# Altium project Machkhuechdaiamthanh.PrjPcb
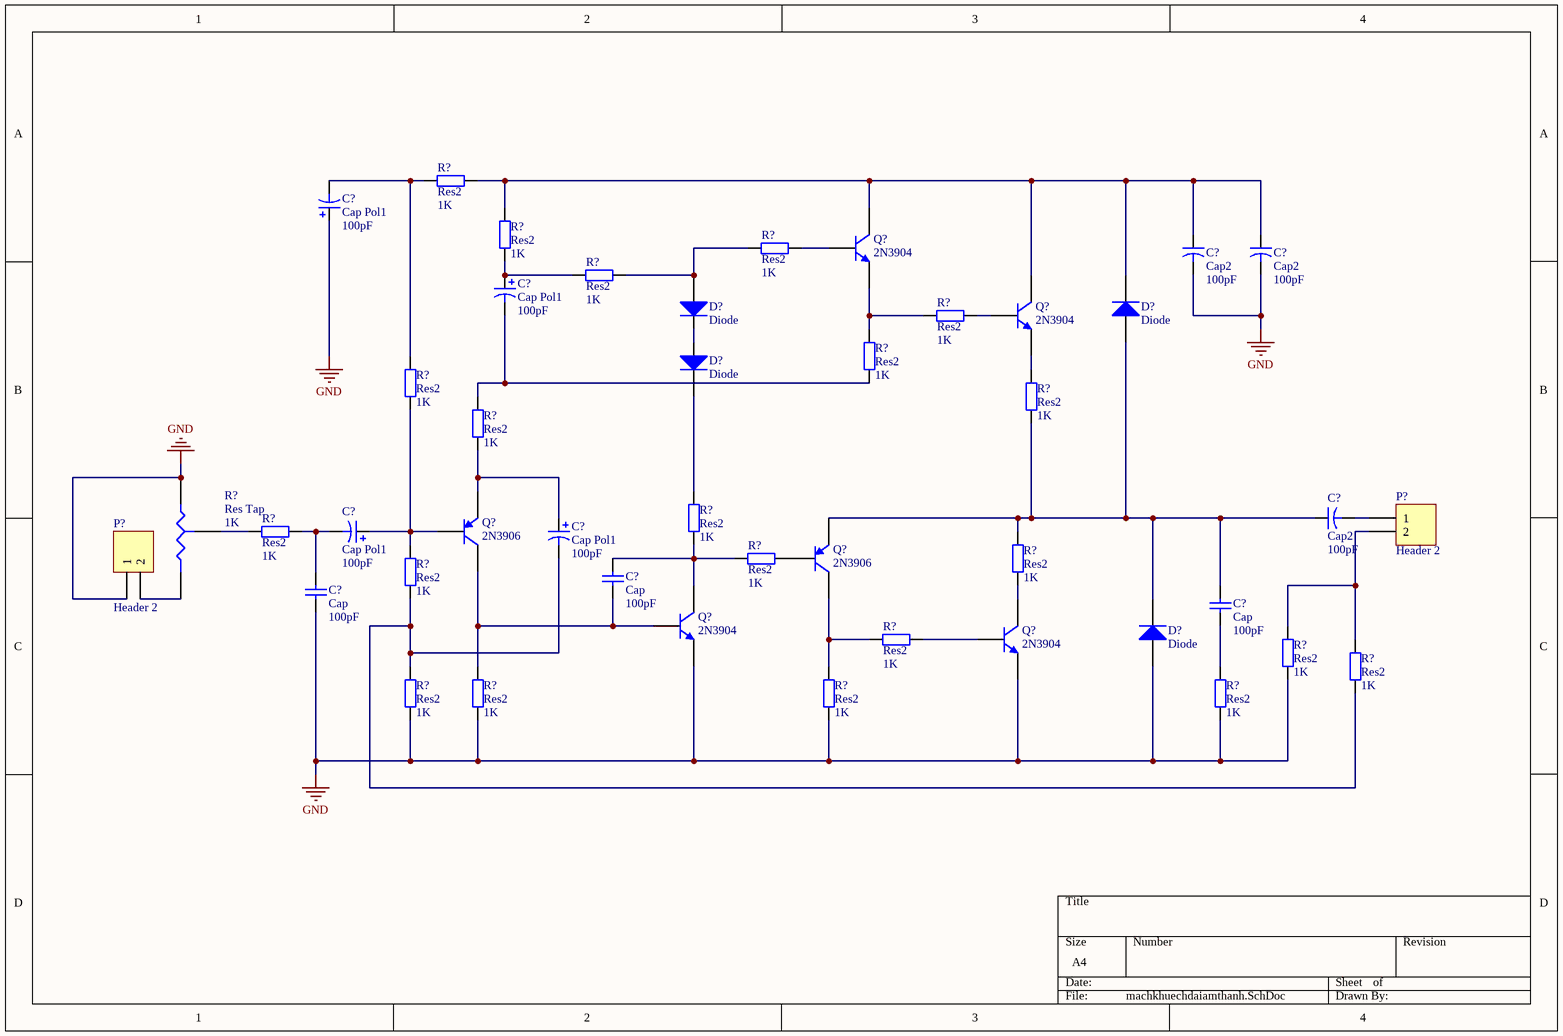
[diagram p0: machkhuechdaiamthanh.SchDoc]
1 sheet, 44 parts. Net scope: global (net labels, ports and power ports of the same name join across sheets).

## Sheet machkhuechdaiamthanh.SchDoc
size A4; SheetNumber: 1; SheetTotal: 1; SPICEModelCacheBAEEVXQT: <root> / <DocumentId>BAEEVXQT</DocumentId> / <CacheFrame Number="0"> / <Model Name="diode" Kind="MDL"> / <Text>*Default Diode / *Diode Pinout: A,K / .MODEL DIODE D()</Text> / </Model> / <Model Name="2n3904" Kind="MDL"> / <Text>*2N3904 / *Si 310mW  40V 200mA 300MHz pkg:TO-92B 1,2,3 / .MODEL 2N3904 NPN(IS=1.4E-14 BF=300 VAF=100 IKF=0.025 ISE=3E-13 / + BR=7.5 RC=2.4 CJE=4.5E-12 TF=4E-10 CJC=3.5E-12 TR=2.1E-8 XTB=1.5 KF=9E-16 )</Text> / </Model> / <Model Name="2n3906" Kind="MDL"> / <Text>*2N3906 / *Si 310mW  40V 200mA 250MHz pkg:TO-92B 1,2,3 / .MODEL 2N3906 PNP(IS=4E-14 BF=400 VAF=50 IKF=0.02 ISE=7E-15 NE=1.16 / + BR=7.5 RC=2.4 CJE=6.3E-12 VJE=0.75 TF=5E-10 CJC=5.8E-12 VJC=0.75 TR=2.3E-8 / + VJS=0.75 XTB=1.5 KF=6E-16 )</Text> / </Model> / </CacheFrame> / </root>

### Parts
(Parts that share a designator on the sheet are numbered #1, #2 ... from top to bottom, then left to right.)
C?#1  Cap Pol1  value 100pF  [RB7.6-15]
C?#2  Cap2  value 100pF  [CAPR5-4X5]
C?#3  Cap2  value 100pF  [CAPR5-4X5]
C?#4  Cap Pol1  value 100pF  [RB7.6-15]
C?#5  Cap2  value 100pF  [CAPR5-4X5]
C?#6  Cap Pol1  value 100pF  [RB7.6-15]
C?#7  Cap Pol1  value 100pF  [RB7.6-15]
C?#8  Cap  value 100pF  [RAD-0.3]
C?#9  Cap  value 100pF  [RAD-0.3]
C?#10  Cap  value 100pF  [RAD-0.3]
D?#1  Diode  [SMC]
D?#2  Diode  [SMC]
D?#3  Diode  [SMC]
D?#4  Diode  [SMC]
P?#1  Header 2  [HDR1X2]
P?#2  Header 2  [HDR1X2]
Q?#1  2N3904  [TO-92A]
Q?#2  2N3904  [TO-92A]
Q?#3  2N3906  [TO-92A]
Q?#4  2N3906  [TO-92A]
Q?#5  2N3904  [TO-92A]
Q?#6  2N3904  [TO-92A]
R?#1  Res2  value 1K  [AXIAL-0.4]
R?#2  Res2  value 1K  [AXIAL-0.4]
R?#3  Res2  value 1K  [AXIAL-0.4]
R?#4  Res2  value 1K  [AXIAL-0.4]
R?#5  Res2  value 1K  [AXIAL-0.4]
R?#6  Res2  value 1K  [AXIAL-0.4]
R?#7  Res2  value 1K  [AXIAL-0.4]
R?#8  Res2  value 1K  [AXIAL-0.4]
R?#9  Res2  value 1K  [AXIAL-0.4]
R?#10  Res Tap  value 1K  [VR3]
R?#11  Res2  value 1K  [AXIAL-0.4]
R?#12  Res2  value 1K  [AXIAL-0.4]
R?#13  Res2  value 1K  [AXIAL-0.4]
R?#14  Res2  value 1K  [AXIAL-0.4]
R?#15  Res2  value 1K  [AXIAL-0.4]
R?#16  Res2  value 1K  [AXIAL-0.4]
R?#17  Res2  value 1K  [AXIAL-0.4]
R?#18  Res2  value 1K  [AXIAL-0.4]
R?#19  Res2  value 1K  [AXIAL-0.4]
R?#20  Res2  value 1K  [AXIAL-0.4]
R?#21  Res2  value 1K  [AXIAL-0.4]
R?#22  Res2  value 1K  [AXIAL-0.4]

### Nets
GND: C?#1.1 C?#2.2 C?#3.2 C?#9.1 D?#4.1(A) P?#2.1 Q?#5.1(E) Q?#6.1(E) R?#10.1(A) R?#17.1 R?#19.1 R?#20.1 R?#21.1 R?#22.1
NetC?#1_2: C?#1.2 R?#1.1 R?#7.2
NetC?#2_1: C?#2.1 C?#3.1 D?#2.2(K) Q?#1.3(C) Q?#2.3(C) R?#1.2 R?#3.2
NetC?#4_1: C?#4.1 R?#3.1 R?#4.1
NetC?#4_2: C?#4.2 R?#6.1 R?#9.2
NetC?#5_1: C?#5.1 C?#10.2 D?#2.1(A) D?#4.2(K) Q?#4.1(E) R?#8.1 R?#14.2
NetC?#5_2: C?#5.2 P?#1.1
NetC?#6_1: C?#6.1 Q?#3.1(E) R?#9.1
NetC?#6_2: C?#6.2 R?#15.1 R?#18.1 R?#19.2
NetC?#7_1: C?#7.1 Q?#3.2(B) R?#7.1 R?#15.2
NetC?#7_2: C?#7.2 C?#9.2 R?#11.2
NetC?#8_1: C?#8.1 Q?#3.3(C) Q?#5.2(B) R?#20.2
NetC?#8_2: C?#8.2 Q?#5.3(C) R?#12.1 R?#13.2
NetC?#10_1: C?#10.1 R?#22.2
NetD?#1_1: D?#1.1(A) R?#2.1 R?#4.2
NetD?#1_2: D?#1.2(K) D?#3.1(A)
NetD?#3_2: D?#3.2(K) R?#12.2
NetP?#1_2: P?#1.2 R?#17.2 R?#18.2
NetP?#2_2: P?#2.2 R?#10.2(B)
NetQ?#1_1: Q?#1.1(E) R?#5.1 R?#6.2
NetQ?#1_2: Q?#1.2(B) R?#2.2
NetQ?#2_1: Q?#2.1(E) R?#8.2
NetQ?#2_2: Q?#2.2(B) R?#5.2
NetQ?#4_2: Q?#4.2(B) R?#13.1
NetQ?#4_3: Q?#4.3(C) R?#16.2 R?#21.2
NetQ?#6_2: Q?#6.2(B) R?#16.1
NetQ?#6_3: Q?#6.3(C) R?#14.1
NetR?#10_3: R?#10.3(TAP) R?#11.1

### Library data of the parts
C?#1 C?#4 C?#6 C?#7 = Cap Pol1: Polarized Capacitor (Radial); Published: 8-Jun-2000; LatestRevisionDate: 17-Jul-2002; LatestRevisionNote: Re-released for DXP Platform.; PackageReference: RB7.6-15; Publisher: Altium Limited; PackageDescription: Polarized Capacitor (Radial); 2 Leads
C?#2 C?#3 C?#5 = Cap2: Capacitor; Published: 23-Sep-2002; PackageReference: CAPR5-4X5; Publisher: Altium Limited; PackageDescription: Capacitor; 2 Leads
C?#8-C?#10 = Cap: Capacitor; Published: 8-Jun-2000; LatestRevisionDate: 17-Jul-2002; LatestRevisionNote: Re-released for DXP Platform.; PackageReference: RAD-0.3; Publisher: Altium Limited; PackageDescription: Radial Cap, Thru-Hole; 2 Leads; 0.3 in Pin Spacing
D?#1-D?#4 = Diode: Default Diode; Published: 8-Jun-2000; LatestRevisionDate: 17-Jul-2002; LatestRevisionNote: Re-released for DXP Platform.; PackageVersion: Sep-1996; PackageReference: SMC; Publisher: Altium Limited; PackageDescription: DO-214-AB/SMC; 2 C-Bend Leads; Body 7.9 x 5.9 mm, inc. leads (LxW); Code_JEDEC: DO-214-AB
P?#1 P?#2 = Header 2: Header, 2-Pin; LatestRevisionDate: 17-Jul-2002; LatestRevisionNote: Re-released for DXP Platform.; Publisher: Altium Limited
Q?#1 Q?#2 Q?#5 Q?#6 = 2N3904: NPN General Purpose Amplifier; Published: 8-Jun-2000; LatestRevisionDate: 15-Jan-2003; LatestRevisionNote: PCB Footprint 'BCY-W3/D4.7' replaced; DatasheetVersion: 1997; PackageVersion: Sep-1998; PackageReference: TO-92A; Publisher: Altium Limited; PackageDescription: TO, Flat Index; 3 In-Line, Axial Leads; Body Dia. 4.5mm; Leads 0.51 x 0.48 mm (max); ComponentLink1Description: Manufacturer Link; ComponentLink1URL: http://www.fairchildsemi.com/; ComponentLink2Description: Datasheet; ComponentLink2URL: http://www.fairchildsemi.com/ds/2N%2F2N3904.pdf
Q?#3 Q?#4 = 2N3906: PNP General Purpose Amplifier; Published: 8-Jun-2000; LatestRevisionDate: 15-Jan-2003; LatestRevisionNote: PCB Footprint 'BCY-W3/D4.7' replaced; DatasheetVersion: 1997; PackageVersion: Sep-1998; PackageReference: TO-92A; Publisher: Altium Limited; PackageDescription: TO, Flat Index; 3 In-Line, Axial Leads; Body Dia. 4.5mm; Leads 0.51 x 0.48 mm (max); ComponentLink1Description: Manufacturer Link; ComponentLink1URL: http://www.fairchildsemi.com/; ComponentLink2Description: Datasheet; ComponentLink2URL: http://www.fairchildsemi.com/ds/2N%2F2N3906.pdf
R?#1-R?#9 R?#11-R?#22 = Res2: Resistor; Published: 8-Jun-2000; LatestRevisionDate: 17-Jul-2002; LatestRevisionNote: Re-released for DXP Platform.; PackageReference: AXIAL-0.4; Publisher: Altium Limited; PackageDescription: Axial Device, Thru-Hole; 2 Leads; 0.4 in Pin Spacing
R?#10 = Res Tap: Tapped Resistor; Sim Note: Enter the Resistance value and the set point into parameter fields.; Set Position: 0.5; Published: 24-Mar-1999; LatestRevisionDate: 17-Jul-2002; LatestRevisionNote: Re-released for DXP Platform.; PackageReference: VR3; Publisher: Altium Limited; PackageDescription: Variable Resistor, Thru-Hole; 3 Leads